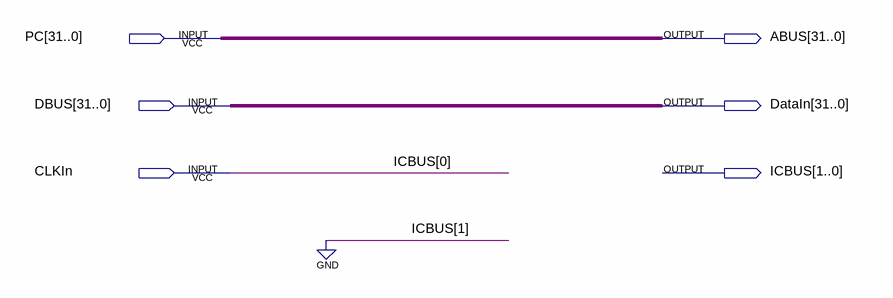
[diagram p0: schematic sheet]
// Quartus schematic IBIU.bdf as structural Verilog: 0 symbols, 6 pins
module IBIU (
  input  [31:0] PC,
  input  [31:0] DBUS,
  input  CLKIn,
  output [31:0] ABUS,
  output [31:0] DataIn,
  output [1:0] ICBUS
);


  assign ABUS = PC;
  assign DataIn = DBUS;
  assign ICBUS = {1'b0, CLKIn};
endmodule
